# EasyEDA schematic FP Battery Protector.json
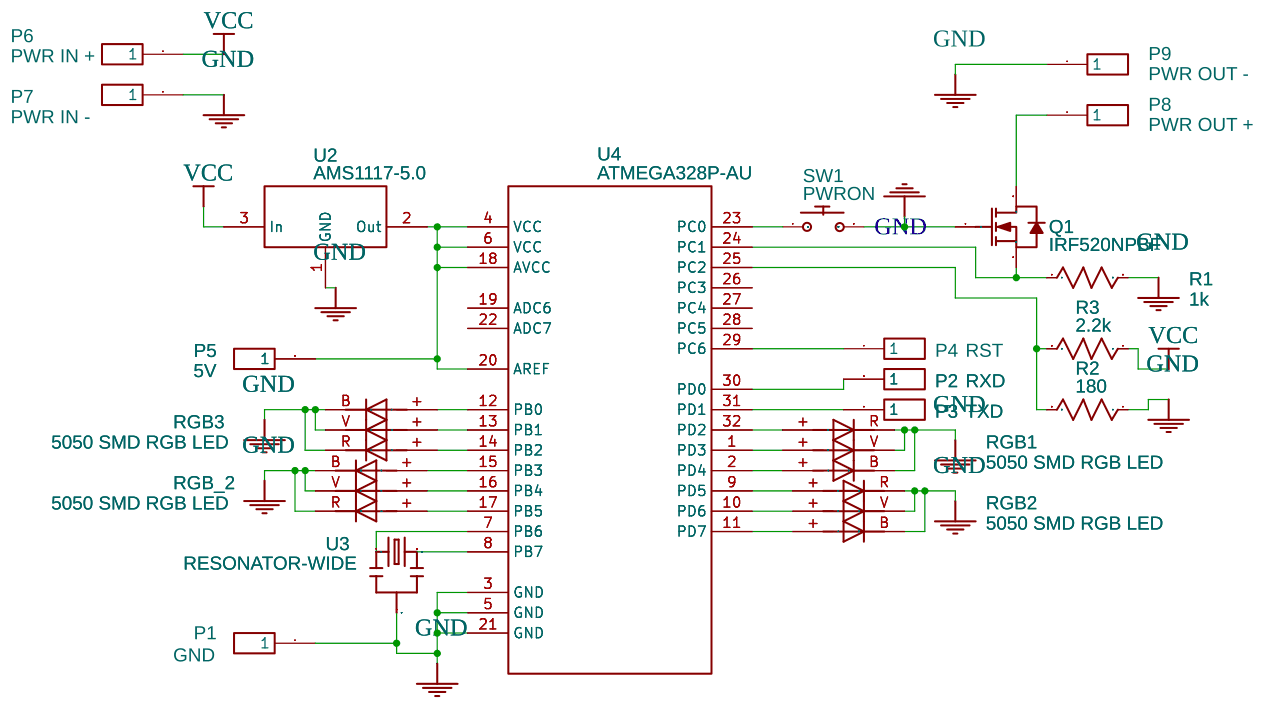
[diagram p0: schematic sheet]

## Parts
P1  GND  [HDR-1X1/2.54]
P2  RXD  [HDR-1X1/2.54]
P3  TXD  [HDR-1X1/2.54]
P4  RST  [HDR-1X1/2.54]
P5  5V  [HDR-1X1/2.54]
P6  PWR IN +  [HDR-1X1/2.54]
P7  PWR IN -  [HDR-1X1/2.54]
P8  PWR OUT +  [HDR-1X1/2.54]
P9  PWR OUT -  [HDR-1X1/2.54]
Q1  IRF520NPBF  [TO-220(TO-220-3)]
R1  1k  [CASE-P_2012]
R2  180  [CASE-P_2012]
R3  2.2k  [CASE-P_2012]
RGB1  5050 SMD RGB LED  [5050-RGB]
RGB2  5050 SMD RGB LED  [5050-RGB]
RGB3  5050 SMD RGB LED  [5050-RGB]
RGB_2  5050 SMD RGB LED  [5050-RGB]
SW1  PWRON  [COM-08720]
U2  AMS1117-5.0  [SOT-223]
U3  RESONATOR-WIDE  [RESONATOR3-SMD-3.6X1.3X0.8MM]
U4  ATMEGA328P-AU  [TQFP-32_7X7X08P]

## Library data of the parts
P1-P9 = -: Supplier: LCSC; Manufacturer: ReliaPro; Manufacturer Part: Header 1*1P; LCSC: C81276
Q1 = -: Supplier: LCSC; Manufacturer: IR; LCSC: C2598
R1-R3 = Res_AXIAL-0.3(1/8W)_US: Manufacturer Part: ?
RGB1-RGB3 RGB_2 = -: Contributor: frederic.vigreux; Manufacturer Part: ?
SW1 = -: Contributor: damtac84; Supplier: Mouser; Mouser: 474-COM-08720; link: http://www.sparkfun.com/datasheets/Components/Buttons/SMD-Button.pdf
U2 = -: sourceId: HltLFyQwq; Supplier: LCSC; Manufacturer: AMS; LCSC: C6187; LCSC Assembly: Yes; image: //image.lceda.cn/szlcsc/C6187.jpg
U3 = -: Contributor: SparkFun; Manufacturer Part: ?
U4 = -: Supplier: LCSC; Manufacturer: MICROCHIP; LCSC: C14877; image: //image.lceda.cn/szlcsc/C14877.jpg

## Nets
GND: P1.1 P7.1 P9.1 Q1.1(G) R1.2 R2.1 RGB1.B RGB1.R RGB1.V RGB2.B RGB2.R RGB2.V RGB3.B RGB3.R RGB3.V RGB_2.B RGB_2.R RGB_2.V SW1.2(P$2) U2.1(GND) U3.2 U4.3(GND) U4.5(GND) U4.21(GND)
VCC: P6.1 R3.1 U2.3(In)
Net-(P2-1): P2.1 U4.30(PD0)
Net-(P3-1): P3.1 U4.31(PD1)
Net-(P4-1): P4.1 U4.29(PC6)
Net-(P5-1): P5.1 U2.2(Out) U4.4(VCC) U4.6(VCC) U4.18(AVCC) U4.20(AREF)
Net-(P8-1): P8.1 Q1.2(D)
Net-(Q1-3): Q1.3(S) R1.1 U4.24(PC1)
Net-(R2-2): R2.2 R3.2 U4.25(PC2)
Net-(RGB1-+): RGB1.+(3) U4.1(PD3) U4.2(PD4) U4.32(PD2)
Net-(RGB2-+): RGB2.+(3) U4.9(PD5) U4.10(PD6) U4.11(PD7)
Net-(RGB3-+): RGB3.+(3) U4.12(PB0) U4.13(PB1) U4.14(PB2)
Net-(RGB_2-+): RGB_2.+(3) U4.15(PB3) U4.16(PB4) U4.17(PB5)
Net-(SW1-1): SW1.1(P$1) U4.23(PC0)
Net-(U3-1): U3.1 U4.7(PB6)
Net-(U3-3): U3.3 U4.8(PB7)

Not connected (* = marked no-connect by the designer): U4 19(ADC6) 22(ADC7) 26(PC3) 27(PC4) 28(PC5)
